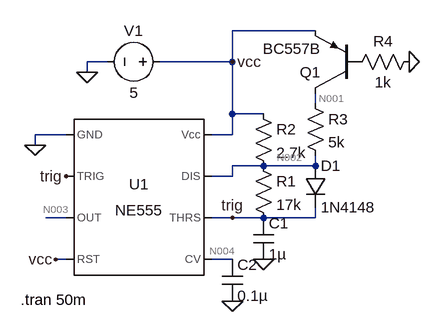
[diagram p0: schematic servo_con.asc]
servo_con.asc, the LTspice schematic file:
Version 4
SHEET 1 880 680
WIRE 448 -80 320 -80
WIRE 128 -32 96 -32
WIRE 320 -32 320 -80
WIRE 320 -32 208 -32
WIRE 96 -16 96 -32
WIRE 448 32 448 16
WIRE 320 48 320 -32
WIRE 368 48 320 48
WIRE 64 80 16 80
WIRE 320 80 320 48
WIRE 320 80 288 80
WIRE 16 96 16 80
WIRE 368 128 320 128
WIRE 448 128 448 112
WIRE 448 128 368 128
WIRE 320 144 320 128
WIRE 320 144 288 144
WIRE 64 208 32 208
WIRE 320 208 288 208
WIRE 368 208 320 208
WIRE 448 208 448 192
WIRE 448 208 368 208
WIRE 64 272 48 272
WIRE 320 272 288 272
FLAG 96 -16 0
FLAG 16 96 0
FLAG 368 272 0
FLAG 64 144 trig
FLAG 48 272 vcc
FLAG 320 -32 vcc
FLAG 320 208 trig
FLAG 320 336 0
FLAG 592 -32 0
SYMBOL Misc\\NE555 176 176 R0
SYMATTR InstName U1
SYMBOL voltage 224 -32 R90
WINDOW 0 -32 56 VBottom 2
WINDOW 3 32 56 VTop 2
WINDOW 123 0 0 Left 2
WINDOW 39 0 0 Left 2
SYMATTR InstName V1
SYMATTR Value 5
SYMBOL cap 352 208 R0
SYMATTR InstName C1
SYMATTR Value 1µ
SYMBOL res 352 112 R0
SYMATTR InstName R1
SYMATTR Value 17k
SYMBOL res 352 32 R0
SYMATTR InstName R2
SYMATTR Value 2.7k
SYMBOL diode 432 128 R0
SYMATTR InstName D1
SYMATTR Value 1N4148
SYMBOL cap 304 272 R0
SYMATTR InstName C2
SYMATTR Value 0.1µ
SYMBOL pnp 512 16 R180
SYMATTR InstName Q1
SYMATTR Value BC557B
SYMBOL res 432 16 R0
SYMATTR InstName R3
SYMATTR Value 5k
SYMBOL res 608 -48 R90
WINDOW 0 0 56 VBottom 2
WINDOW 3 32 56 VTop 2
SYMATTR InstName R4
SYMATTR Value 1k
TEXT -6 334 Left 2 !.tran 50m

The netlist it stands for:
* servo_con.asc
XU1 0 trig N003 vcc N004 trig N002 vcc NE555  ; pins GND TRIG OUT RST CV THRS DIS Vcc
V1 vcc 0 5
C1 trig 0 1µ
R1 N002 trig 17k
R2 vcc N002 2.7k
D1 N002 trig 1N4148
C2 N004 0 0.1µ
Q1 N001 P001 vcc 0 BC557B
R3 N001 N002 5k
R4 0 P001 1k
.model D D
.lib standard.dio
.model NPN NPN
.model PNP PNP
.lib standard.bjt
.tran 50m
.lib NE555.sub
.backanno
.end

* Results of the author's LTspice run, read from the files saved beside the schematic
* Operating Point, zero values left out:
*   V(trig) = 4.997 V
*   V(n004) = 3.333 V
*   V(vcc) = 5 V
*   V(n002) = 4.997 V
*   V(n003) = 5 V
*   V(n001) = 4.991 V
*   V(p001) = 4.263 V
*   Ic(Q1) = 1.16 µA
*   Ib(Q1) = -4.263 mA
*   Ie(Q1) = 4.262 mA
*   I(D1) = 9.457 pA
*   I(R4) = -4.263 mA
*   I(R3) = -1.16 µA
*   I(R2) = 1.176 µA
*   I(R1) = 9.984 nA
*   I(V1) = -5.874 mA
*   Ix(u1:1) = -1.611 mA
*   Ix(u1:2) = 4.997 nA
*   Ix(u1:4) = 22.67 µA
*   Ix(u1:6) = 4.997 nA
*   Ix(u1:7) = 6.667 nA
*   Ix(u1:8) = 1.588 mA
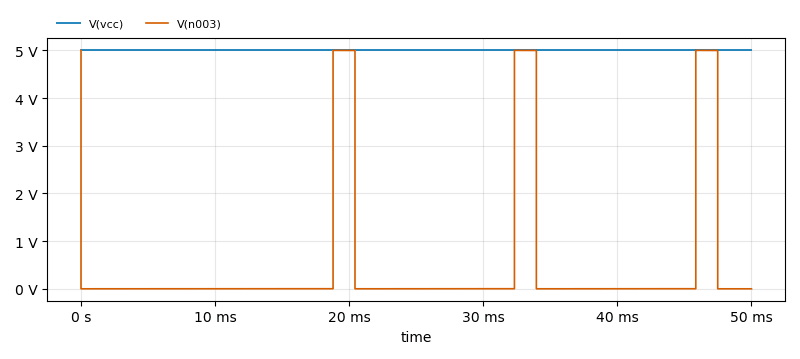
[diagram p1: Transient Analysis of servo_con.asc, plotted from the saved traces]
* Transient Analysis, 1 run:
*   V(vcc): min 5 V, max 5 V, average 5 V, rms 5 V, last 5 V
*   V(n003): min 30 µV, max 5 V, average 490.5 mV, rms 1.566 V, last 30 µV